# EasyEDA Pro project ProPrj_HydromatMK1_2025-12-27_13-47-41_2026-04-05.epro, schematic HydromatMK1
Board Name: HydromatMK1; Create Date: 2025-12-27; Page Name: Sheet_1; Project Name: HydromatMK1_2025-12-27_13-47-41; Schematic Name: HydromatMK1; Update Date: 2026-03-11; Add into BOM: yes; Company: Your Company; Convert to PCB: yes; Date: 2025-12-12; REV: 1.0; Sheet: 1/1; spicePre: .
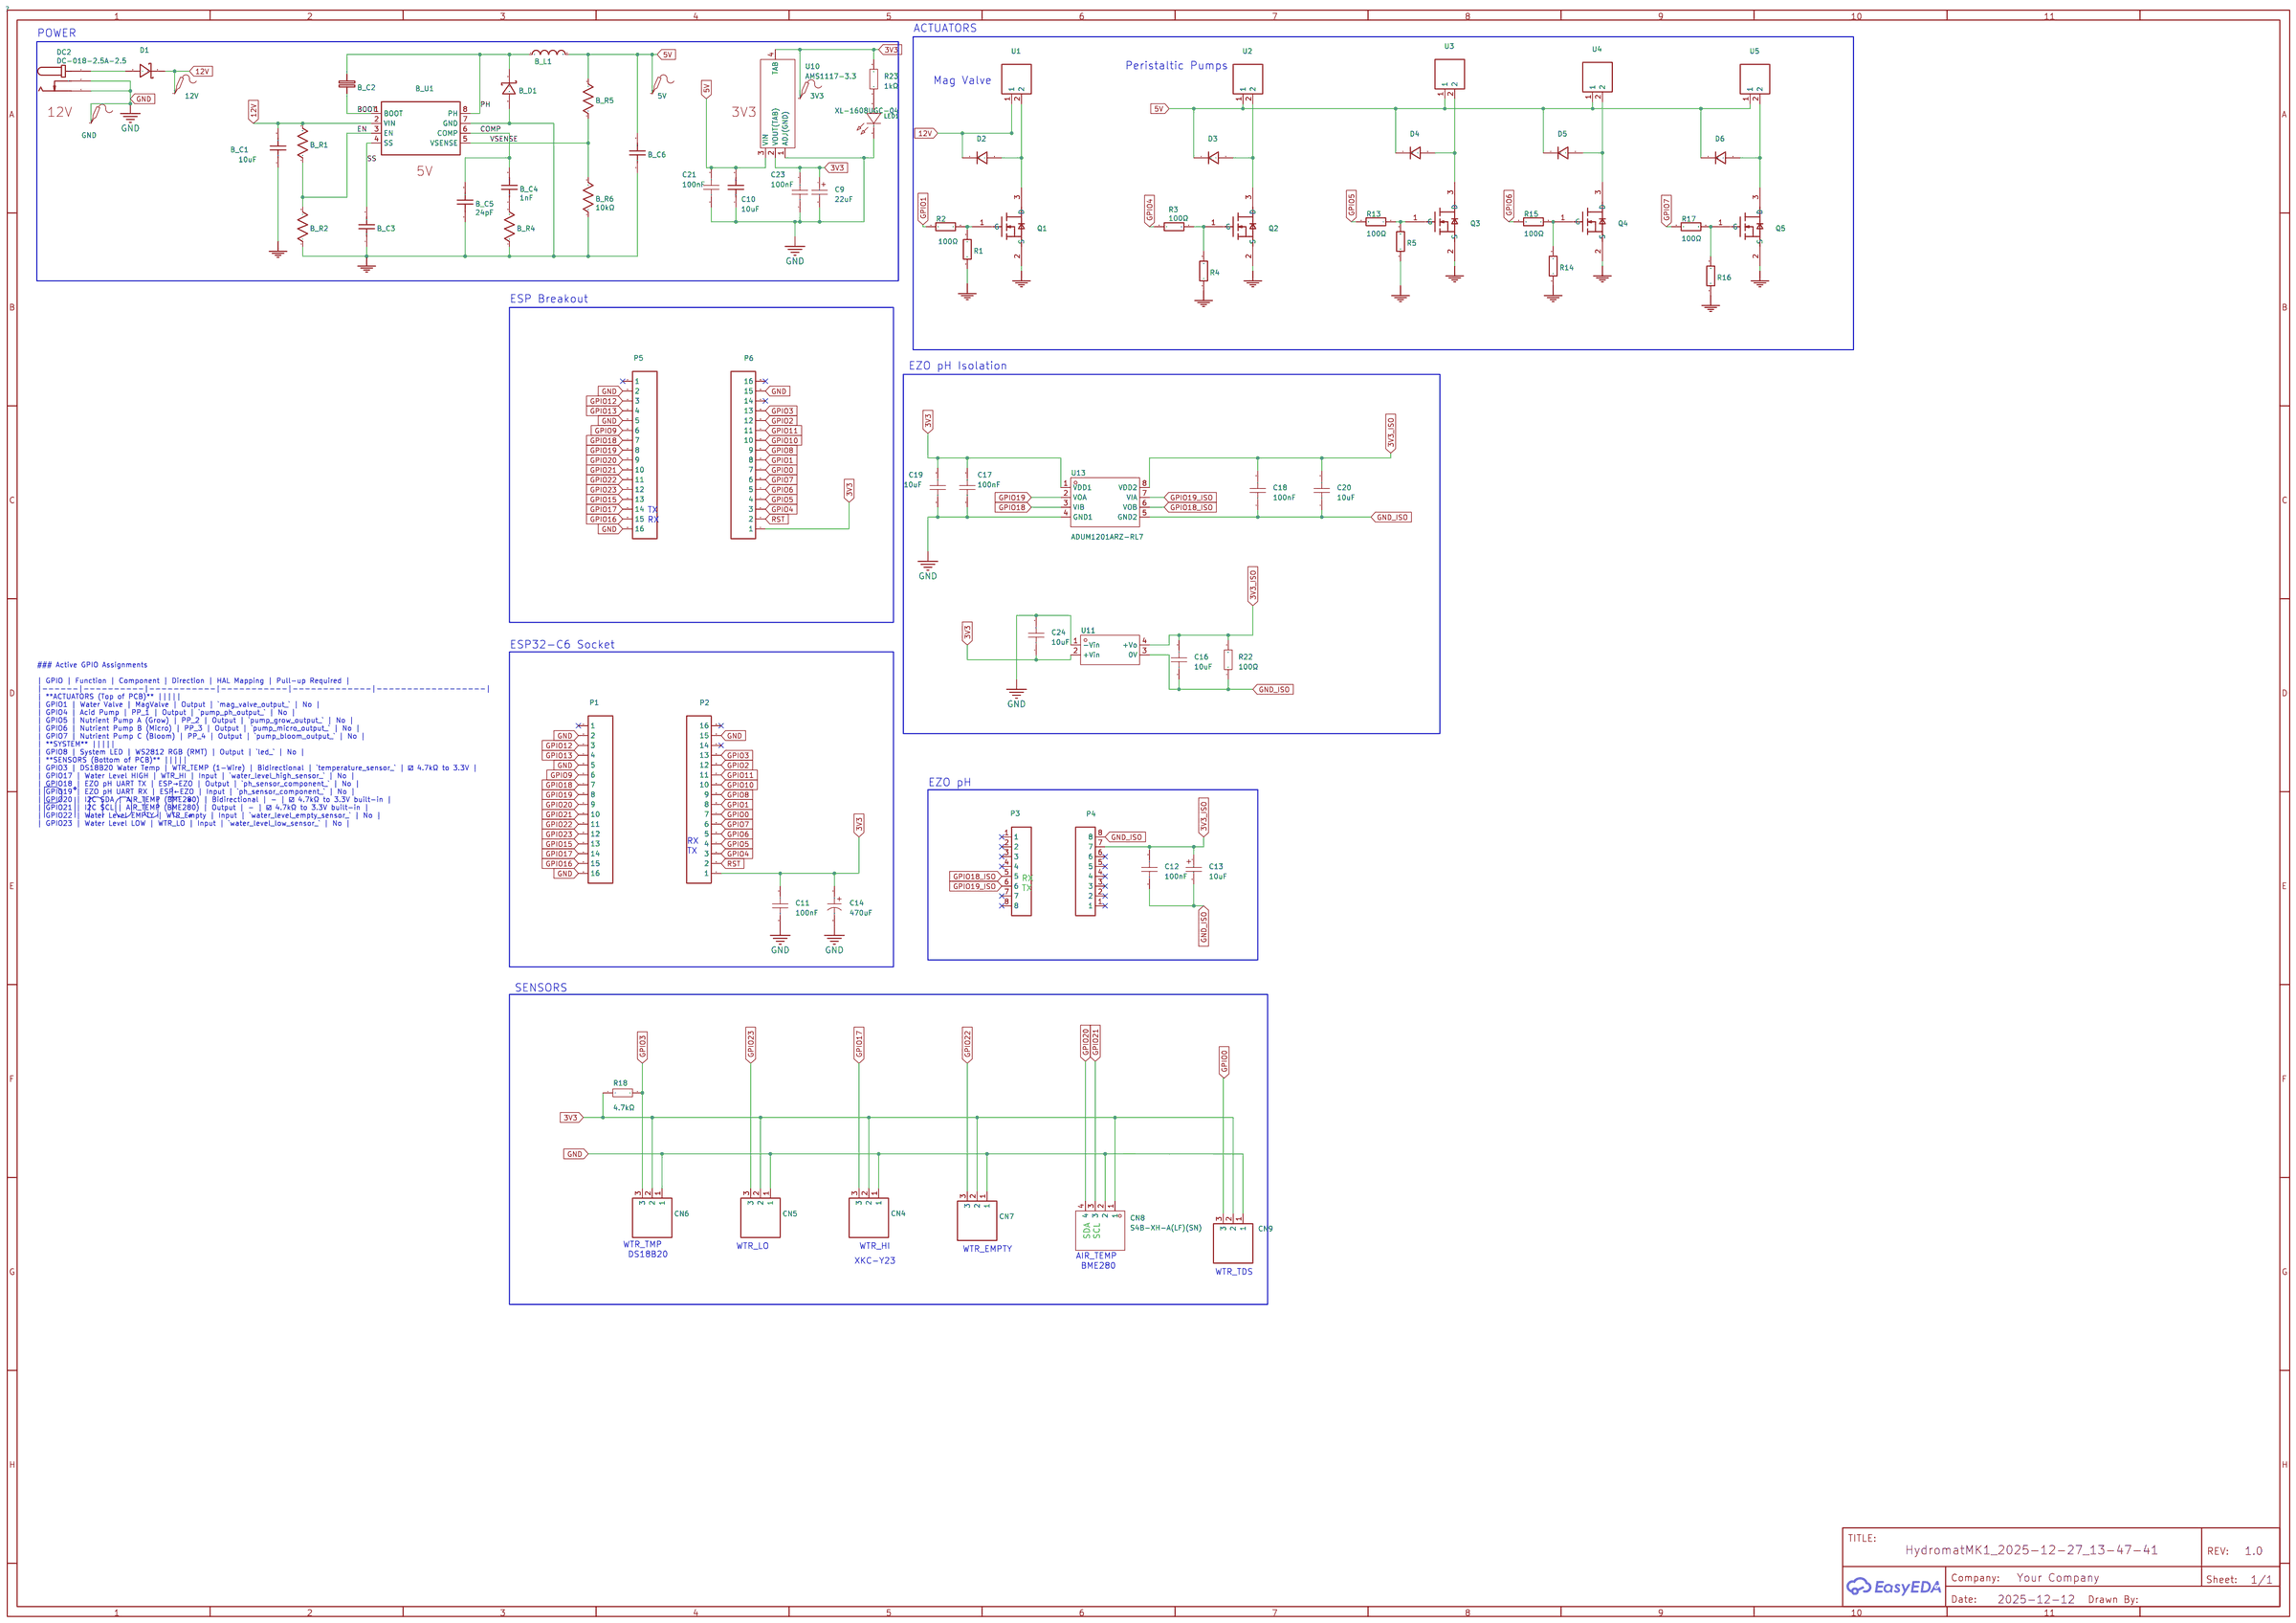
[diagram p0: schematic sheet]

## Parts
3V3  5017  [TEST-SMD_L2.7-W1.0]
5V  5017  [TEST-SMD_L2.7-W1.0]
12V  5017  [TEST-SMD_L2.7-W1.0]
B_C1  10uF  [C0603]
B_C2  100nF  [C0603]
B_C3  8.2nF  [C0805]
B_C4  1nF  [C0805]
B_C5  24pF  [C0805]
B_C6  10uF  [C0805]
B_D1  SS24FL  [SOD-123_L2.6-W1.6-LS3.5-RD]
B_L1  6.8uH  [IND-SMD_L2.5-W2.0_FTC252010S]
B_R1  169kΩ  [R0603]
B_R2  39.2kΩ  [R0603]
B_R4  45.3kΩ  [R0805]
B_R5  10.2kΩ  [R0805]
B_R6  10kΩ  [R0805]
B_U1  TPS54232DR  [SOIC-8_L4.9-W3.9-P1.27-LS6.0-BL]
C9  22uF  [CASE-B_3528]
C10  10uF  [C0805]
C11  100nF  [C0805]
C12  100nF  [C0805]
C13  10uF  [CAP-SMD_L3.2-W1.6-RD-C7171]
C14  470uF  [CAP-SMD_BD10.0-L10.3-W10.3-LS11.0-FD]
C16  10uF  [C0805]
C17  100nF  [C0805]
C18  100nF  [C0805]
C19  10uF  [C0805]
C20  10uF  [C0805]
C21  100nF  [C0805]
C23  100nF  [C0805]
C24  10uF  [C0805]
CN4  S3B-XH-A-1(LF)(SN)  [CONN-TH_S3B-XH-A-1-LF-SN]
CN5  S3B-XH-A-1(LF)(SN)  [CONN-TH_S3B-XH-A-1-LF-SN]
CN6  S3B-XH-A-1(LF)(SN)  [CONN-TH_S3B-XH-A-1-LF-SN]
CN7  S3B-XH-A-1(LF)(SN)  [CONN-TH_S3B-XH-A-1-LF-SN]
CN8  S4B-XH-A(LF)(SN)  [CONN-TH_S4B-XH-A-LF-SN]
CN9  S3B-XH-A-1(LF)(SN)  [CONN-TH_S3B-XH-A-1-LF-SN]
D1  SS54  [SMA_L4.3-W2.6-LS5.1-RD]
D2  SS24  [SMA_L4.3-W2.6-LS5.0-FD]
D3  SS24  [SMA_L4.3-W2.6-LS5.0-FD]
D4  SS24  [SMA_L4.3-W2.6-LS5.0-FD]
D5  SS24  [SMA_L4.3-W2.6-LS5.0-FD]
D6  SS24  [SMA_L4.3-W2.6-LS5.0-FD]
DC2  DC-018-2.5A-2.5  [DC-IN-TH_DC-018]
GND  5017  [TEST-SMD_L2.7-W1.0]
LED1  XL-1608UGC-04  [LED0603-RD_GREEN]
P1  ZX-PM2.54-1-16PY  [HDR-TH_16P-P2.54-V-F-1]
P2  ZX-PM2.54-1-16PY  [HDR-TH_16P-P2.54-V-F-1]
P3  2.54-1*8P母环保  [HDR-TH_8P-P2.54-V-F_2]
P4  2.54-1*8P母环保  [HDR-TH_8P-P2.54-V-F_2]
P5  ZX-PM2.54-1-16PY  [HDR-TH_16P-P2.54-V-F-1]
P6  ZX-PM2.54-1-16PY  [HDR-TH_16P-P2.54-V-F-1]
Q1  IRLML6244TRPBF  [SOT-23-3_L2.9-W1.3-P1.90-LS2.4-BR]
Q2  IRLML6244TRPBF  [SOT-23-3_L2.9-W1.3-P1.90-LS2.4-BR]
Q3  IRLML6244TRPBF  [SOT-23-3_L2.9-W1.3-P1.90-LS2.4-BR]
Q4  IRLML6244TRPBF  [SOT-23-3_L2.9-W1.3-P1.90-LS2.4-BR]
Q5  IRLML6244TRPBF  [SOT-23-3_L2.9-W1.3-P1.90-LS2.4-BR]
R1  10kΩ  [R0805]
R2  100Ω  [R0805]
R3  100Ω  [R0805]
R4  10kΩ  [R0805]
R5  10kΩ  [R0805]
R13  100Ω  [R0805]
R14  10kΩ  [R0805]
R15  100Ω  [R0805]
R16  10kΩ  [R0805]
R17  100Ω  [R0805]
R18  4.7kΩ  [R0805]
R22  100Ω  [R0805]
R23  1kΩ  [R0805]
U1  S2B-XH-A-1(LF)(SN)  [CONN-TH_S2B-XH-A-1-LF-SN]
U2  S2B-XH-A-1(LF)(SN)  [CONN-TH_S2B-XH-A-1-LF-SN]
U3  S2B-XH-A-1(LF)(SN)  [CONN-TH_S2B-XH-A-1-LF-SN]
U4  S2B-XH-A-1(LF)(SN)  [CONN-TH_S2B-XH-A-1-LF-SN]
U5  S2B-XH-A-1(LF)(SN)  [CONN-TH_S2B-XH-A-1-LF-SN]
U10  AMS1117-3.3  [SOT-223-4_L6.5-W3.5-P2.30-LS7.0-BR]
U11  220kHz  [PWRM-TH_B0303S-1WR3]
U13  ADUM1201ARZ-RL7  [SOIC-8_L4.9-W3.9-P1.27-LS6.0-BL]

## Library data of the parts
3V3 5V 12V GND = 5017_C238130: Connector Type:Ferrite Ring (SMD) Plastic Color:Non-Plastic Board Space (Diameter φ/ Length x Width):3.4mmx1.8mm; Supplier Part: C238130; Manufacturer: Keystone; JLCPCB Part Class: Extended Part; Datasheet: https://item.szlcsc.com/datasheet/5017/237378.html; Supplier: LCSC; Connector Type: Ferrite Ring (SMD); Plastic Color: Non-Plastic; Board Space (Diameter φ/ Length x Width): 3.4mmx1.8mm
B_C1 = CL10A106MO8NQNC: Capacitance:10uF Tolerance:±20% Tolerance:±20% Voltage Rating:16V Temperature Coefficient:X5R; LCSC Part Name: 10uF ±20% 16V; Supplier Part: C92487; Manufacturer: SAMSUNG(三星); Supplier Footprint: 0603; JLCPCB Part Class: Extended Part; Datasheet: https://item.szlcsc.com/datasheet/CL10A106MO8NQNC/93680.html; Supplier: LCSC; Tolerance: ±20%; Voltage Rating: 16V; Temperature Coefficient: X5R
B_C2 = CC0603KRX7R9BB104: Capacitance:100nF Tolerance:±10% Tolerance:±10% Voltage Rating:50V Temperature Coefficient:X7R; LCSC Part Name: 100nF ±10% 50V; Supplier Part: C14663; Manufacturer: YAGEO(国巨); Supplier Footprint: 0603; JLCPCB Part Class: Basic Part; Datasheet: https://item.szlcsc.com/datasheet/CC0603KRX7R9BB104/15331.html; Supplier: LCSC; Tolerance: ±10%; Voltage Rating: 50V; Temperature Coefficient: X7R
B_C3 = CC0805JRX7R9BB822: Capacitance:8.2nF Tolerance:±5% Tolerance:±5% Voltage Rating:50V Temperature Coefficient:X7R; LCSC Part Name: 8.2nF ±5% 50V; Supplier Part: C309490; Manufacturer: YAGEO(国巨); Supplier Footprint: 0805; JLCPCB Part Class: Extended Part; Datasheet: https://item.szlcsc.com/datasheet/CC0805JRX7R9BB822/293106.html; Supplier: LCSC; Tolerance: ±5%; Voltage Rating: 50V; Temperature Coefficient: X7R; nameAlias: Value(F); Contributor: LCEDA_Lib
B_C4 = CL21B102KBCNNNC: Capacitance:1nF Tolerance:±10% Tolerance:±10% Voltage Rating:50V Temperature Coefficient:X7R; LCSC Part Name: 1nF ±10% 50V; Supplier Part: C46653; Manufacturer: SAMSUNG(三星); Supplier Footprint: 0805; JLCPCB Part Class: Basic Part; Datasheet: https://item.szlcsc.com/datasheet/CL21B102KBCNNNC/47657.html; Supplier: LCSC; Tolerance: ±10%; Voltage Rating: 50V; Temperature Coefficient: X7R
B_C5 = 0805CG240J500NT: Capacitance:24pF Tolerance:±5% Tolerance:±5% Voltage Rating:50V Temperature Coefficient:C0G; LCSC Part Name: 24pF ±5% 50V; Supplier Part: C1806; Manufacturer: FH(风华); Supplier Footprint: 0805; JLCPCB Part Class: Extended Part; Datasheet: https://item.szlcsc.com/datasheet/0805CG240J500NT/2158.html; Supplier: LCSC; Tolerance: ±5%; Voltage Rating: 50V; Temperature Coefficient: C0G
B_C6 = CL21A106KBYQNNE: Capacitance:10uF Tolerance:±10% Tolerance:±10% Voltage Rating:50V Temperature Coefficient:X5R; LCSC Part Name: 10uF ±10% 50V; Supplier Part: C2932476; Manufacturer: SAMSUNG(三星); Supplier Footprint: 0805; JLCPCB Part Class: Extended Part; Datasheet: https://item.szlcsc.com/datasheet/CL21A106KBYQNNE/3277789.html; Supplier: LCSC; Tolerance: ±10%; Voltage Rating: 50V; Temperature Coefficient: X5R; nameAlias: Value(F); Contributor: LCEDA_Lib
B_D1 = SS24FL: Voltage - Forward(Vf@If):550mV@2A Voltage - DC Reverse(Vr):40V Current - Rectified:2A Non-Repetitive Peak Forward Surge Current:50A; LCSC Part Name: 电压:40V 电流:2A; Supplier Part: C489144; Manufacturer: KEXIN(科信); Supplier Footprint: SOD-123FL; JLCPCB Part Class: Extended Part; Datasheet: https://item.szlcsc.com/datasheet/SS24FL/499168.html; Supplier: LCSC; Voltage - Forward(Vf@If): 550mV@2A; Voltage - DC Reverse(Vr): 40V; Current - Rectified: 2A; Non-Repetitive Peak Forward Surge Current: 50A; Contributor: LCSC; spicePre: D; spiceSymbolName: SS24FL_C489144
B_L1 = FTC252012S6R8MBCA: Inductance:6.8uH Tolerance:±20% Tolerance:±20% Current Rating:1.6A Current - Saturation(Isat):2A DC Resistance(DCR):245mΩ Type:-; LCSC Part Name: 6.8uH ±20% 2A; Supplier Part: C5832375; Manufacturer: cjiang(长江微电); Supplier Footprint: 1008; JLCPCB Part Class: Extended Part; Datasheet: https://item.szlcsc.com/datasheet/FTC252012S6R8MBCA/6763495.html; Supplier: LCSC; Tolerance: ±20%; Current Rating: 1.6A; Current - Saturation(Isat): 2A; DC Resistance(DCR): 245mΩ; nameAlias: Value(H); Contributor: LCEDA_Lib; spicePre: L; spiceSymbolName: L0805_US
B_R1 = 0603WAF1693T5E: Type:Thick Film Resistors Resistance:169kΩ Tolerance:±1% Tolerance:±1% Power(Watts): Overload Voltage (Max): Temperature Coefficient:±100ppm/℃ Temperature Coefficient:±100ppm/℃ Operating Temperature Range:-55℃~+155℃ Operating Temperature Range:-55℃~+155℃; LCSC Part Name: 169kΩ ±1% 100mW 厚膜电阻; Supplier Part: C22817; Manufacturer: UNI-ROYAL(厚声); Supplier Footprint: 0603; JLCPCB Part Class: Extended Part; Datasheet: https://atta.szlcsc.com/upload/public/pdf/source/20200306/C422600_1E6D84923E4A46A82E41ADD87F860B5C.pdf; Supplier: LCSC; Type: Thick Film Resistors; Tolerance: ±1%; Temperature Coefficient: ±100ppm/℃; Operating Temperature Range: -55℃~+155℃; nameAlias: Value(Ω); Contributor: LCEDA_Lib; spicePre: R; spiceSymbolName: R_0805_US; Voltage-Supply(Max): 50V; Operating Temperature: -55℃~+155℃
B_R2 = 0603WAF3922T5E: Type:Thick Film Resistor Resistance:39.2kΩ Tolerance:±1% Tolerance:±1% Power(Watts):100mW Voltage-Supply(Max):75V Temperature Coefficient:±100ppm/℃ Temperature Coefficient:±100ppm/℃ Operating Temperature:-55℃~+155℃ Operating Temperature:-55℃~+155℃; LCSC Part Name: 39.2kΩ ±1% 100mW 厚膜电阻; Supplier Part: C23037; Manufacturer: UNI-ROYAL(厚声); Supplier Footprint: 0603; JLCPCB Part Class: Extended Part; Datasheet: https://item.szlcsc.com/datasheet/0603WAF3922T5E/23764.html; Supplier: LCSC; Type: Thick Film Resistor; Tolerance: ±1%; Power(Watts): 100mW; Voltage-Supply(Max): 75V; Temperature Coefficient: ±100ppm/℃; Operating Temperature: -55℃~+155℃; nameAlias: Value(Ω); Contributor: LCEDA_Lib; spicePre: R; spiceSymbolName: R_0805_US
B_R4 = FRC0805F4532TS: Type:Thick Film Resistor Resistance:45.3kΩ Tolerance:±1% Tolerance:±1% Power(Watts):125mW Voltage-Supply(Max):150V Temperature Coefficient:±100ppm/℃ Temperature Coefficient:±100ppm/℃ Operating Temperature:-55℃~+155℃ Operating Temperature:-55℃~+155℃; LCSC Part Name: 45.3kΩ ±1% 125mW 厚膜电阻; Supplier Part: C2933446; Manufacturer: FOJAN(富捷); Supplier Footprint: 0805; JLCPCB Part Class: Extended Part; Datasheet: https://item.szlcsc.com/datasheet/FRC0805F4532TS/3279548.html; Supplier: LCSC; Type: Thick Film Resistor; Tolerance: ±1%; Power(Watts): 125mW; Voltage-Supply(Max): 150V; Temperature Coefficient: ±100ppm/℃; Operating Temperature: -55℃~+155℃; nameAlias: Value(Ω); Contributor: LCEDA_Lib; spicePre: R; spiceSymbolName: R_0805_US
B_R5 = FRC0805F1022TS: Type:Thick Film Resistor Resistance:10.2kΩ Tolerance:±1% Tolerance:±1% Power(Watts):125mW Voltage-Supply(Max):150V Temperature Coefficient:±100ppm/℃ Temperature Coefficient:±100ppm/℃ Operating Temperature:-55℃~+155℃ Operating Temperature:-55℃~+155℃; LCSC Part Name: 10.2kΩ ±1% 125mW 厚膜电阻; Supplier Part: C2933282; Manufacturer: FOJAN(富捷); Supplier Footprint: 0805; JLCPCB Part Class: Extended Part; Supplier: LCSC; Type: Thick Film Resistor; Tolerance: ±1%; Power(Watts): 125mW; Voltage-Supply(Max): 150V; Temperature Coefficient: ±100ppm/℃; Operating Temperature: -55℃~+155℃; nameAlias: Value(Ω); Contributor: LCEDA_Lib; spicePre: R; spiceSymbolName: R_0805_US
B_R6 = FRC0805J103TS: Type:Thick Film Resistor Resistance:10kΩ Tolerance:±5% Tolerance:±5% Power(Watts):125mW Voltage-Supply(Max):150V Temperature Coefficient:±100ppm/℃ Temperature Coefficient:±100ppm/℃ Operating Temperature:-55℃~+155℃ Operating Temperature:-55℃~+155℃; LCSC Part Name: 10kΩ ±5% 125mW 厚膜电阻; Supplier Part: C2930231; Manufacturer: FOJAN(富捷); Supplier Footprint: 0805; JLCPCB Part Class: Extended Part; Supplier: LCSC; Type: Thick Film Resistor; Tolerance: ±5%; Power(Watts): 125mW; Voltage-Supply(Max): 150V; Temperature Coefficient: ±100ppm/℃; Operating Temperature: -55℃~+155℃
B_U1 = TPS54232DR: Function:Step-down type Output Type:Adjustable Input Voltage:3.5V~28V Input Voltage:3.5V~28V Output Voltage:800mV~28V Output Voltage:800mV~28V Output Current:2A Switching Frequency:1MHz Switching Frequency:1MHz Operating Temperature:-40℃~+150℃ Operating T; LCSC Part Name: 28V、2A、1MHz降压DC-DC转换器; Supplier Part: C52653; Manufacturer: TI(德州仪器); Supplier Footprint: SOIC-8; JLCPCB Part Class: Extended Part; Datasheet: http://www.ti.com/cn/lit/gpn/tps54232; Supplier: LCSC; Function: Step-down type; Output Type: Adjustable; Input Voltage: 3.5V~28V; Output Voltage: 800mV~28V; Output Current: 2A; Switching Frequency: 1MHz; Operating Temperature: -40℃~+150℃; Synchronous Rectification: No; Number of Outputs: 1; Topology: Step-down; Switch tube (built-in/external): Built-in; Contributor: LCSC; spicePre: U
C9 = TAJB226K016RNJ: Capacitance:22uF Tolerance:±10% Tolerance:±10% Voltage Rating:16V Equivalent Series Resistance(ESR):2.3Ω@100kHz Operating Temperature:-55℃~+125℃ Operating Temperature:-55℃~+125℃; LCSC Part Name: 22uF ±10% 16V; Supplier Part: C8020; Manufacturer: Kyocera AVX; Supplier Footprint: CASE-B-3528-21(mm); JLCPCB Part Class: Extended Part; Supplier: LCSC; Tolerance: ±10%; Voltage Rating: 16V; Equivalent Series Resistance(ESR): 2.3Ω@100kHz; Operating Temperature: -55℃~+125℃
C10 = 10uF: Supplier: LCSC; Manufacturer Part: CL21A106KAYNNNE; Manufacturer: SAMSUNG(三星); Supplier Part: C15850; JLCPCB Part Class: Basic Part; nameAlias: Value; spicePre: C; spiceSymbolName: CL21A106KAYNNNE
C11 C12 C17 C18 C21 C23 = CC0805KRX7R9BB104: Capacitance:100nF Tolerance:±10% Tolerance:±10% Voltage Rating:50V Temperature Coefficient:X7R; LCSC Part Name: 100nF ±10% 50V; Supplier Part: C49678; Manufacturer: YAGEO(国巨); Supplier Footprint: 0805; JLCPCB Part Class: Basic Part; Datasheet: https://item.szlcsc.com/datasheet/CC0805KRX7R9BB104/50686.html; Supplier: LCSC; Tolerance: ±10%; Voltage Rating: 50V; Temperature Coefficient: X7R
C13 = TAJA106K016RNJ: Capacitance:10uF Tolerance:±10% Tolerance:±10% Voltage Rating:16V Equivalent Series Resistance(ESR):3Ω@100kHz Operating Temperature:-55℃~+125℃ Operating Temperature:-55℃~+125℃; LCSC Part Name: 10uF ±10% 16V; Supplier Part: C7171; Manufacturer: Kyocera AVX; Supplier Footprint: CASE-A-3216-18(mm); Supplier: LCSC; Tolerance: ±10%; Voltage Rating: 16V; Equivalent Series Resistance(ESR): 3Ω@100kHz; Operating Temperature: -55℃~+125℃
C14 = RVT1E471M1010: Capacitance: Tolerance:±20% Tolerance:±20% Rated Voltage: Ripple Current:- Equivalent Series Resistance(ESR):- φD: L: Lifetime @ Temp:2000hrs@105℃ Operating Temperature:-55℃~+105℃ Operating Temperature:-55℃~+105℃; LCSC Part Name: 470uF ±20% 25V; Supplier Part: C3351; Manufacturer: HONOR(荣誉); Supplier Footprint: SMD,D10xL10.2mm; JLCPCB Part Class: Extended Part; Datasheet: https://atta.szlcsc.com/upload/public/pdf/source/20210521/C113284_25C86AE95FB541053FE695F13EA8E7D0.pdf; Supplier: LCSC; Tolerance: ±20%; Lifetime @ Temp: 2000hrs@105℃; Operating Temperature: -55℃~+105℃; Voltage Rating: 35V; Diameter: 10mm; Height - Seated (Max): 10.2mm
C16 C19 C20 C24 = GRM21BR71A106KE51L: Capacitance: Tolerance:±10% Tolerance:±10% Voltage Rated: Temperature Coefficient:; LCSC Part Name: 10uF ±10% 10V; Supplier Part: C86038; Manufacturer: muRata(村田); Supplier Footprint: 0805; JLCPCB Part Class: Extended Part; Datasheet: https://atta.szlcsc.com/upload/public/pdf/source/20200305/C490387_23319AE8C154DEB24C505E6C82A8106A.pdf; Supplier: LCSC; Tolerance: ±10%
CN4-CN7 CN9 = S3B-XH-A-1(LF)(SN): Pins Structure:1x3P Pitch:2.5mm Mounting Type:Right Angle Reference Series:XH Number of Pins:3P Number of Rows:1 Number of PINs Per Row:3 Row Spacing:- Current Rating:3A Contact Material:Brass Contact Plating:Tin Operating Temperature:-25℃~+85℃ Operating; LCSC Part Name: 1x3P 间距:2.5mm 弯插 系列:XH; Supplier Part: C163036; Manufacturer: JST; Supplier Footprint: 弯插,P=2.5mm; JLCPCB Part Class: Extended Part; Datasheet: https://item.szlcsc.com/datasheet/S3B-XH-A-1(LF)(SN)/174417.html; Supplier: LCSC; Pins Structure: 1x3P; Pitch: 2.5mm; Mounting Type: Right Angle; Reference Series: XH; Number of Pins: 3P; Number of Rows: 1; Number of PINs Per Row: 3; Current Rating: 3A; Contact Material: Brass; Contact Plating: Tin; Operating Temperature: -25℃~+85℃; Voltage Rating: 250V; Plastic Material: PA66; Flame Retardant Rating: UL94V-0; Supplementary Features: K Pin; Color: White; Z-Height of the Board: 6.1mm; X-Length of Bottom Edge on Board (Spacing Line): 9.9mm; Y-Width of Bottom Edge on Board: 11.5mm; Contributor: LCSC; spicePre: C; spiceSymbolName: S3B-XH-A (LF)(SN)
CN8 = S4B-XH-A(LF)(SN): Pins Structure:1x4P Pitch:2.5mm Mounting Type:Right Angle Reference Series:XH Number of Pins:4P Number of Rows:1 Number of PINs Per Row:4 Row Spacing:- Current Rating:3A Contact Material:Brass Contact Plating:Tin Operating Temperature:-25℃~+85℃ Operating; LCSC Part Name: 1x4P 间距:2.5mm 弯插 系列:XH; Supplier Part: C157925; Manufacturer: JST; Supplier Footprint: 弯插,P=2.5mm; JLCPCB Part Class: Extended Part; Datasheet: https://item.szlcsc.com/datasheet/S4B-XH-A(LF)(SN)/169273.html; Supplier: LCSC; Pins Structure: 1x4P; Pitch: 2.5mm; Mounting Type: Right Angle; Reference Series: XH; Number of Pins: 4P; Number of Rows: 1; Number of PINs Per Row: 4; Current Rating: 3A; Contact Material: Brass; Contact Plating: Tin; Operating Temperature: -25℃~+85℃; Voltage Rating: 250V; Plastic Material: PA66; Flame Retardant Rating: UL94V-0; Supplementary Features: K Pin; Color: White; Z-Height of the Board: 6.1mm; X-Length of Bottom Edge on Board (Spacing Line): 12.4mm; Y-Width of Bottom Edge on Board: 11.5mm
D1 = SS54_C20609300: Voltage - Forward(Vf@If):550mV@5A Voltage - DC Reverse(Vr):40V Current - Rectified:5A Reverse Leakage Current (Ir):100uA@40V Operating Junction Temperature Range:-55℃~+150℃ Operating Junction Temperature Range:-55℃~+150℃ Non-Repetitive Peak Forward Surge; LCSC Part Name: 电压:40V 电流:5A; Supplier Part: C20609300; Manufacturer: JSMSEMI(杰盛微); Supplier Footprint: SMA; JLCPCB Part Class: Extended Part; Datasheet: https://item.szlcsc.com/datasheet/SS54/21959862.html; Supplier: LCSC; Voltage - Forward(Vf@If): 550mV@5A; Voltage - DC Reverse(Vr): 40V; Current - Rectified: 5A; Reverse Leakage Current (Ir): 100uA@40V; Operating Junction Temperature Range: -55℃~+150℃; Non-Repetitive Peak Forward Surge Current: 100A; Contributor: LCSC; spicePre: D; spiceSymbolName: MBRS140T3G
D2-D6 = SS24_C7420362: Diode Configuration:Independent Voltage - Forward(Vf@If):550mV@2A Voltage - DC Reverse(Vr):40V Current - Rectified:2A Reverse Leakage Current (Ir):200uA@40V Operating Junction Temperature Range:-55℃~+150℃ Operating Junction Temperature Range:-55℃~+150℃ No; LCSC Part Name: 电压:40V 电流:2A; Supplier Part: C7420362; Manufacturer: R+O(宏嘉诚); Supplier Footprint: SMA(DO-214AC); JLCPCB Part Class: Extended Part; Datasheet: https://item.szlcsc.com/datasheet/SS24/8397184.html; Supplier: LCSC; Diode Configuration: Independent; Voltage - Forward(Vf@If): 550mV@2A; Voltage - DC Reverse(Vr): 40V; Current - Rectified: 2A; Reverse Leakage Current (Ir): 200uA@40V; Operating Junction Temperature Range: -55℃~+150℃; Non-Repetitive Peak Forward Surge Current: 50A; spicePre: D
DC2 = DC-018-2.5A-2.5: Supplier: LCSC; Supplier Part: C2880553; Manufacturer: XKB Connection(中国星坤); JLCPCB Part Class: Extended Part; Contributor: lcsc; spicePre: D
LED1 = XL-1608UGC-04: Lamp Holder Type:- Illumination Color:Emerald Green Voltage - Forward(Vf):3.3V Voltage - Forward(Vf):3.3V Power(Watts):70mW Forward Current:20mA Wavelength - Dominant:515nm~535nm Wavelength - Dominant:515nm~535nm Peak Wavelength:525nm Diode Configuration:; LCSC Part Name: 0603翠绿贴片式发光二极管; Supplier Part: C965804; Manufacturer: XINGLIGHT(成兴光); Supplier Footprint: 0603; JLCPCB Part Class: Extended Part; Datasheet: https://item.szlcsc.com/datasheet/XL-1608UGC-04/1051413.html; Supplier: LCSC; Illumination Color: Emerald Green; Voltage - Forward(Vf): 3.3V; Power(Watts): 70mW; Forward Current: 20mA; Wavelength - Dominant: 515nm~535nm; Peak Wavelength: 525nm; Diode Configuration: Discrete Diode; Lens Color: Water Clear; Luminous Intensity: 810mcd; Viewing Angle: 120°; Mounting Style: Top-mount; Operating Temperature: -40℃~+85℃
P1 P2 P5 P6 = ZX-PM2.54-1-16PY: Holes Structure:1x16P Pitch:2.54mm Row Spacing:- Circular Hole / Square Hole:Square Hole Mounting Type:Through Hole Number of Rows:1 Number of Positions:16P Current Rating:3A Voltage Rating (Max):- Holes Direction:Top Insulation Height:8.5mm Contact Mater; LCSC Part Name: 1x16P 间距:2.54mm 直插; Supplier Part: C7499334; Manufacturer: Megastar(兆星); Supplier Footprint: 插件,P=2.54mm; JLCPCB Part Class: Extended Part; Datasheet: https://item.szlcsc.com/datasheet/ZX-PM2.54-1-16PY/8573995.html; Supplier: LCSC; Holes Structure: 1x16P; Pitch: 2.54mm; Circular Hole / Square Hole: Square Hole; Mounting Type: Through Hole; Number of Rows: 1; Number of Positions: 16P; Current Rating: 3A; Holes Direction: Top; Insulation Height: 8.5mm; Contact Material: Brass; Contact Plating: Gold; Operating Temperature: -40℃~+105℃; PIN Length: 3.2mm; spicePre: P; spiceSymbolName: Header-Female-2.54_1x16
P3 P4 = 2.54-1*8P母环保: Holes Structure:1x8P Pitch:2.54mm Row Spacing:- Circular Hole / Square Hole:Square Hole Mounting Type:Through Hole Number of Rows:1 Number of Positions:8P Current Rating:3A Holes Direction:Top Insulation Height:8.5mm Contact Material:Brass Contact Plating; LCSC Part Name: 1x8P 间距:2.54mm 直插; Supplier Part: C27438; Manufacturer: BOOMELE(博穆精密); Supplier Footprint: 插件,P=2.54mm; JLCPCB Part Class: Extended Part; Datasheet: https://item.szlcsc.com/datasheet/2.54-1*8P%25E6%25AF%258D%25E7%258E%25AF%25E4%25BF%259D/28187.html; Supplier: LCSC; Holes Structure: 1x8P; Pitch: 2.54mm; Circular Hole / Square Hole: Square Hole; Mounting Type: Through Hole; Number of Rows: 1; Number of Positions: 8P; Current Rating: 3A; Holes Direction: Top; Insulation Height: 8.5mm; Contact Material: Brass; Contact Plating: Gold; Operating Temperature: -55℃~+105℃; PIN Length: 3.2mm; spicePre: P; spiceSymbolName: Header-Female-2.54_1x8
Q1-Q5 = IRLML6244TRPBF: Number:1 N-Channel Drain to Source Voltage:20V Current - Continuous Drain(Id):6.3A RDS(on):27mΩ@2.5V,5.1A Pd - Power Dissipation:1.3W Gate Threshold Voltage (Vgs(th)):1.1V@10uA Gate Charge(Qg):8.9nC@4.5V Input Capacitance(Ciss):700pF Reverse Transfer Capa; LCSC Part Name: 1个N沟道 耐压:20V 电流:6.3A; Supplier Part: C143946; Manufacturer: Infineon(英飞凌); Supplier Footprint: SOT-23; JLCPCB Part Class: Extended Part; Datasheet: https://item.szlcsc.com/datasheet/IRLML6244TRPBF/155278.html; Supplier: LCSC; Number: 1 N-Channel; Drain to Source Voltage: 20V; Current - Continuous Drain(Id): 6.3A; RDS(on): 27mΩ@2.5V,5.1A; Pd - Power Dissipation: 1.3W; Gate Threshold Voltage (Vgs(th)): 1.1V@10uA; Gate Charge(Qg): 8.9nC@4.5V; Input Capacitance(Ciss): 700pF; Reverse Transfer Capacitance (Crss@Vds): 98pF; Output Capacitance(Coss): 140pF; Contributor: lcsc; spicePre: Q; spiceSymbolName: IRLML6244TRPBF_C5123965
R1 R4 R5 R14 R16 = 0805W8F1002T5E: Type:Thick Film Resistor Resistance:10kΩ Tolerance:±1% Tolerance:±1% Power(Watts):125mW Voltage-Supply(Max):150V Temperature Coefficient:±100ppm/℃ Temperature Coefficient:±100ppm/℃ Operating Temperature:-55℃~+155℃ Operating Temperature:-55℃~+155℃; LCSC Part Name: 10kΩ ±1% 125mW 厚膜电阻; Supplier Part: C17414; Manufacturer: UNI-ROYAL(厚声); Supplier Footprint: 0805; JLCPCB Part Class: Basic Part; Datasheet: https://item.szlcsc.com/datasheet/0805W8F1002T5E/18102.html; Supplier: LCSC; Type: Thick Film Resistor; Tolerance: ±1%; Power(Watts): 125mW; Voltage-Supply(Max): 150V; Temperature Coefficient: ±100ppm/℃; Operating Temperature: -55℃~+155℃; nameAlias: Value
R2 R3 R13 R15 R17 = 0805W8F1000T5E_C17408: Type:Thick Film Resistors Resistance: Tolerance:±1% Tolerance:±1% Power(Watts): Overload Voltage (Max): Temperature Coefficient:±100ppm/℃ Temperature Coefficient:±100ppm/℃ Operating Temperature Range:-55℃~+155℃ Operating Temperature Range:-55℃~+155℃; LCSC Part Name: 100Ω ±1% 125mW 厚膜电阻; Supplier Part: C17408; Manufacturer: UNI-ROYAL(厚声); Manufacturer Part: 0805W8F1000T5E; Supplier Footprint: 0805; JLCPCB Part Class: Basic Part; Datasheet: https://atta.szlcsc.com/upload/public/pdf/source/20200306/C422600_1E6D84923E4A46A82E41ADD87F860B5C.pdf; Supplier: LCSC; Type: Thick Film Resistors; Tolerance: ±1%; Temperature Coefficient: ±100ppm/℃; Operating Temperature Range: -55℃~+155℃; Voltage-Supply(Max): 150V
R18 = 0805W8F4701T5E: Type:Thick Film Resistors Resistance:4.7kΩ Tolerance:±1% Tolerance:±1% Power(Watts): Overload Voltage (Max): Temperature Coefficient:±100ppm/℃ Temperature Coefficient:±100ppm/℃ Operating Temperature Range:-55℃~+155℃ Operating Temperature Range:-55℃~+155℃; LCSC Part Name: 4.7kΩ ±1% 125mW 厚膜电阻; Supplier Part: C17673; Manufacturer: UNI-ROYAL(厚声); Supplier Footprint: 0805; JLCPCB Part Class: Basic Part; Datasheet: https://atta.szlcsc.com/upload/public/pdf/source/20200306/C422600_1E6D84923E4A46A82E41ADD87F860B5C.pdf; Supplier: LCSC; Type: Thick Film Resistors; Tolerance: ±1%; Temperature Coefficient: ±100ppm/℃; Operating Temperature Range: -55℃~+155℃; Voltage-Supply(Max): 75V; Operating Temperature: -55℃~+155℃
R22 = 0805W8F1000T5E_C17408: Type:Thick Film Resistors Resistance: Tolerance:±1% Tolerance:±1% Power(Watts): Overload Voltage (Max): Temperature Coefficient:±100ppm/℃ Temperature Coefficient:±100ppm/℃ Operating Temperature Range:-55℃~+155℃ Operating Temperature Range:-55℃~+155℃; LCSC Part Name: 100Ω ±1% 125mW 厚膜电阻; Supplier Part: C17408; Manufacturer: UNI-ROYAL(厚声); Manufacturer Part: 0805W8F1000T5E; Supplier Footprint: 0805; JLCPCB Part Class: Basic Part; Datasheet: https://atta.szlcsc.com/upload/public/pdf/source/20200306/C422600_1E6D84923E4A46A82E41ADD87F860B5C.pdf; Supplier: LCSC; Type: Thick Film Resistors; Tolerance: ±1%; Temperature Coefficient: ±100ppm/℃; Operating Temperature Range: -55℃~+155℃
R23 = FRC0805J102 TS: Type:Thick Film Resistor Resistance:1kΩ Tolerance:±5% Tolerance:±5% Power(Watts):125mW Voltage-Supply(Max):150V Temperature Coefficient:±100ppm/℃ Temperature Coefficient:±100ppm/℃ Operating Temperature:-55℃~+155℃ Operating Temperature:-55℃~+155℃; LCSC Part Name: 1kΩ ±5% 125mW 厚膜电阻; Supplier Part: C2907295; Manufacturer: FOJAN(富捷); Supplier Footprint: 0805; JLCPCB Part Class: Extended Part; Supplier: LCSC; Type: Thick Film Resistor; Tolerance: ±5%; Power(Watts): 125mW; Voltage-Supply(Max): 150V; Temperature Coefficient: ±100ppm/℃; Operating Temperature: -55℃~+155℃
U1-U5 = S2B-XH-A-1(LF)(SN): Pins Structure:1x2P Pitch:2.5mm Mounting Type:Right Angle Reference Series:XH Number of Pins:2P Number of Rows:1 Number of PINs Per Row:2 Row Spacing:- Current Rating:3A Contact Material:Brass Contact Plating:Tin Operating Temperature:-25℃~+85℃ Operating; LCSC Part Name: 1x2P 间距:2.5mm 弯插 系列:XH; Supplier Part: C163035; Manufacturer: JST; Supplier Footprint: 弯插,P=2.5mm; JLCPCB Part Class: Extended Part; Datasheet: https://item.szlcsc.com/datasheet/S2B-XH-A-1(LF)(SN)/174416.html; Supplier: LCSC; Pins Structure: 1x2P; Pitch: 2.5mm; Mounting Type: Right Angle; Reference Series: XH; Number of Pins: 2P; Number of Rows: 1; Number of PINs Per Row: 2; Current Rating: 3A; Contact Material: Brass; Contact Plating: Tin; Operating Temperature: -25℃~+85℃; Voltage Rating: 250V; Plastic Material: PA66; Flame Retardant Rating: UL94V-0; Supplementary Features: K Pin; Color: White; Z-Height of the Board: 6.1mm; X-Length of Bottom Edge on Board (Spacing Line): 7.4mm; Y-Width of Bottom Edge on Board: 11.5mm; Contributor: LCSC; spicePre: U; spiceSymbolName: S2B-XH-A-(LF)(SN)
U10 = AMS1117-3.3_C347222: Output Type:Fixed Voltage - Supply:12V Output Voltage:3.3V Output Voltage:3.3V Output Current:1A Power Supply Rejection Ratio (PSRR):60dB@(120Hz) Voltage Dropout:1.3V@(1A) standby current:5mA Noise:0.003%Vout Features:Over Current Protection Operating Tem; LCSC Part Name: 3.3V 1A 12V; Supplier Part: C347222; Manufacturer: UMW(友台半导体); Supplier Footprint: SOT-223; JLCPCB Part Class: Extended Part; Datasheet: https://item.szlcsc.com/datasheet/AMS1117-3.3/323882.html; Supplier: LCSC; Output Type: Fixed; Voltage - Supply: 12V; Output Voltage: 3.3V; Output Current: 1A; Power Supply Rejection Ratio (PSRR): 60dB@(120Hz); Voltage Dropout: 1.3V@(1A); standby current: 5mA; Noise: 0.003%Vout; Features: Over Current Protection; Operating Temperature: -40℃~+125℃; Output Configuration: Positive; Number of Outputs: 1
U11 = B0303S-1WR3_C7468813: Function:- Number of Channels:1 Output Power:1W Voltage - Supply:2.97V~3.63V Voltage - Supply:2.97V~3.63V Conversion Efficiency:81% Conversion Efficiency:81% Output Voltage:3.3V Output Voltage:3.3V Output Current(Max):303mA Output Current(Max):303mA Capac; LCSC Part Name: DC-DC转换器; Supplier Part: C7468813; Manufacturer: YLPTEC(易川); Manufacturer Part: B0303S-1WR3; Supplier Footprint: SIP,11.6x6mm; JLCPCB Part Class: Extended Part; Datasheet: https://item.szlcsc.com/datasheet/B0303S-1WR3/8515946.html; Supplier: LCSC; Number of Channels: 1; Output Power: 1W; Voltage - Supply: 2.97V~3.63V; Conversion Efficiency: 81%; Output Voltage: 3.3V; Output Current(Max): 303mA; Capacitive Load(Max): 2400uF; Isolation Voltage(Vrms): 1.5kV; Features: Short Circuit Protection; Operating Temperature: -40℃~+105℃; No-Load Input Current: 10mA; Ripple Noise: 30mVp-p; Length: 11.6mm; Width: 6mm; Height: 10.16mm
U13 = ADUM1201ARZ-RL7: Number of Forward Channels:1 Number of Reverse Channels:1 Data Rate(Max):1Mbps Default Output:- Isolation Voltage(Vrms):2500 CMTI(kV/us):25kV/us Operating Temperature:-40℃~+105℃ Operating Temperature:-40℃~+105℃ Voltage - Supply(VCCA):2.7V~5.5V Voltage - S; LCSC Part Name: 双通道数字隔离器（1/1通道方向性）; Supplier Part: C9669; Manufacturer: ADI(亚德诺); Supplier Footprint: SOIC-8; JLCPCB Part Class: Extended Part; Datasheet: https://item.szlcsc.com/datasheet/ADUM1201ARZ-RL7/10199.html; Supplier: LCSC; Number of Forward Channels: 1; Number of Reverse Channels: 1; Data Rate(Max): 1Mbps; Isolation Voltage(Vrms): 2500; CMTI(kV/us): 25kV/us; Operating Temperature: -40℃~+105℃; Voltage - Supply(VCCA): 2.7V~5.5V; Voltage - Supply(VCCB): 2.7V~5.5V; Propagation Delay(tpd): 50ns

## Nets
3V3: 3V3.1 C9.1 C11.2 C14.1 C17.2 C19.2 C23.2 C24.1 CN4.2 CN5.2 CN6.2 CN7.2 CN8.1 CN9.2 P2.1 P6.1 R18.1 R23.2 U10.2(VOUT(TAB)) U10.4(TAB) U11.2(+Vin) U13.1(VDD1)
3V3_ISO: C12.2 C13.1 C16.2 C18.2 C20.2 P4.7 R22.2 U11.4(+Vo) U13.8(VDD2)
5V: 5V.1 B_C6.2 B_L1.2 B_R5.2 C10.2 C21.2 D3.1(C) D4.1(C) D5.1(C) D6.1(C) U2.1 U3.1 U4.1 U5.1 U10.3(VIN)
12V: 12V.1 B_C1.2 B_R1.2 B_U1.2(VIN) D1.1(K) D2.1(C) U1.1
GND: B_C1.1 B_C3.1 B_C5.1 B_C6.1 B_D1.2(A) B_R2.1 B_R4.1 B_R6.1 B_U1.7(GND) C9.2 C10.1 C11.1 C14.2 C17.1 C19.1 C21.1 C23.1 C24.2 CN4.1 CN5.1 CN6.1 CN7.1 CN8.2 CN9.1 DC2.2 DC2.3 GND.1 LED1.1(K) P1.2 P1.5 P1.16 P2.15 P5.2 P5.5 P5.16 P6.15 Q1.2(S) Q2.2(S) Q3.2(S) Q4.2(S) Q5.2(S) R1.1 R4.1 R5.1 R14.1 R16.1 U10.1(ADJ(GND)) U11.1(-Vin) U13.4(GND1)
GND_ISO: C12.1 C13.2 C16.1 C18.1 C20.1 P4.8 R22.1 U11.3(0V) U13.5(GND2)
BOOT: B_C2.2 B_U1.1(BOOT)
COMP: B_C4.2 B_C5.2 B_U1.6(COMP)
EN: B_R1.1 B_R2.2 B_U1.3(EN)
GPIO0: CN9.3 P2.7 P6.7
GPIO1: P2.8 P6.8 R2.1
GPIO2: P2.12 P6.12
GPIO3: CN6.3 P2.13 P6.13 R18.2
GPIO4: P2.3 P6.3 R3.2
GPIO5: P2.4 P6.4 R13.2
GPIO6: P2.5 P6.5 R15.2
GPIO7: P2.6 P6.6 R17.1
GPIO8: P2.9 P6.9
GPIO9: P1.6 P5.6
GPIO10: P2.10 P6.10
GPIO11: P2.11 P6.11
GPIO12: P1.3 P5.3
GPIO13: P1.4 P5.4
GPIO15: P1.13 P5.13
GPIO16: P1.15 P5.15
GPIO17: CN4.3 P1.14 P5.14
GPIO18: P1.7 P5.7 U13.3(VIB)
GPIO18_ISO: P3.5 U13.6(VOB)
GPIO19: P1.8 P5.8 U13.2(VOA)
GPIO19_ISO: P3.6 U13.7(VIA)
GPIO20: CN8.4 P1.9 P5.9
GPIO21: CN8.3 P1.10 P5.10
GPIO22: CN7.3 P1.11 P5.11
GPIO23: CN5.3 P1.12 P5.12
PH: B_C2.1 B_D1.1(K) B_L1.1 B_U1.8(PH)
RST: P2.2 P6.2
SS: B_C3.2 B_U1.4(SS)
VSENSE: B_R5.1 B_R6.2 B_U1.5(VSENSE)
$1N1: D1.2(A) DC2.1
$1N13: D2.2(A) Q1.3(D) U1.2
$1N20: D4.2(A) Q3.3(D) U3.2
$1N24: D5.2(A) Q4.3(D) U4.2
$1N27: Q4.1(G) R14.2 R15.1
$1N28: D6.2(A) Q5.3(D) U5.2
$1N63: Q2.1(G) R3.1 R4.2
$1N1609: B_C4.1 B_R4.2
$1N3439: D3.2(A) Q2.3(D) U2.2
$1N3479: Q3.1(G) R5.2 R13.1
$1N3487: Q5.1(G) R16.2 R17.2
$1N3521: Q1.1(G) R1.2 R2.2
$1N9552: LED1.2(A) R23.1

Not connected (* = marked no-connect by the designer): P1 1*; P2 14* 16*; P3 1* 2* 3* 4* 7* 8*; P4 1* 2* 3* 4* 5* 6*; P5 1*; P6 14* 16*

## Notes on the sheet
- ACTUATORS
- POWER
- Peristaltic Pumps
- Mag Valve
- 12V
- 3V3
- 5V
- ESP Breakout
- EZO pH Isolation
- RX
- TX
- ESP32-C6 Socket
- EZO pH
- Pinout:
- ### Active GPIO Assignments
  | GPIO | Function | Component | Direction | HAL Mapping | Pull-up Required |
  |------|----------|-----------|-----------|-------------|------------------|
  | **ACTUATORS (Top of PCB)** |||||
  | GPIO1 | Water Valve | MagValve | Output | `mag_valve_output_` | No |
  | GPIO4 | Acid Pump | PP_1 | Output | `pump_ph_output_` | No |
  | GPIO5 | Nutrient Pump A (Grow) | PP_2 | Output | `pump_grow_output_` | No |
  | GPIO6 | Nutrient Pump B (Micro) | PP_3 | Output | `pump_micro_output_` | No |
  | GPIO7 | Nutrient Pump C (Bloom) | PP_4 | Output | `pump_bloom_output_` | No |
  | **SYSTEM** |||||
  | GPIO8 | System LED | WS2812 RGB (RMT) | Output | `led_` | No |
  | **SENSORS (Bottom of PCB)** |||||
  | GPIO3 | DS18B20 Water Temp | WTR_TEMP (1-Wire) | Bidirectional | `temperature_sensor_` | ✅ 4.7kΩ to 3.3V |
  | GPIO17 | Water Level HIGH | WTR_HI | Input | `water_level_high_sensor_` | No |
  | GPIO18 | EZO pH UART TX | ESP→EZO | Output | `ph_sensor_component_` | No |
  | GPIO19 | EZO pH UART RX | ESP←EZO | Input | `ph_sensor_component_` | No |
  | GPIO20 | I2C SDA | AIR_TEMP (BME280) | Bidirectional | - | ✅ 4.7kΩ to 3.3V built-in |
  | GPIO21 | I2C SCL | AIR_TEMP (BME280) | Output | - | ✅ 4.7kΩ to 3.3V built-in |
  | GPIO22 | Water Level EMPTY | WTR_Empty | Input | `water_level_empty_sensor_` | No |
  | GPIO23 | Water Level LOW | WTR_LO | Input | `water_level_low_sensor_` | No |
- RX
- TX
- RX
- TX
- SENSORS
- SDA
- SCL
- WTR_TMP
- WTR_LO
- WTR_HI
- WTR_EMPTY
- DS18B20
- XKC-Y23
- AIR_TEMP
- BME280
- WTR_TDS
